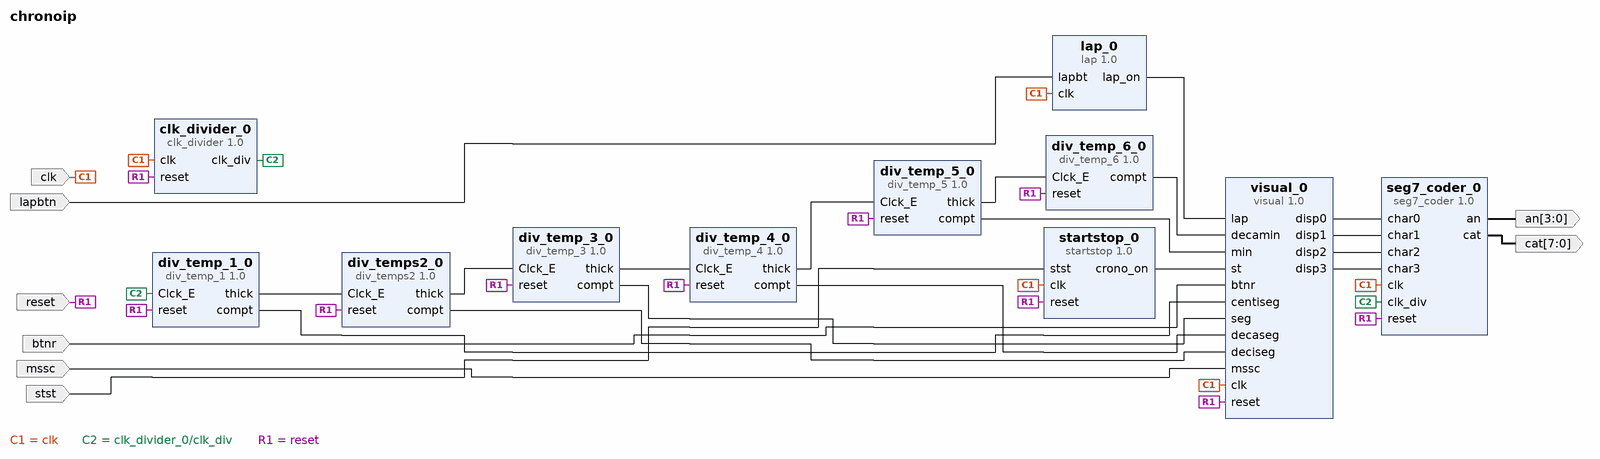
[diagram p0: block diagram of the top level]
# Vivado block design chronoip, xc7a35tcpg236-1, Vivado 2022.1
create_bd_design chronoip

create_bd_port -dir I reset
create_bd_port -dir I clk
create_bd_port -dir I mssc
create_bd_port -dir O -from 3 -to 0 an
create_bd_port -dir O -from 7 -to 0 cat
create_bd_port -dir I stst
create_bd_port -dir I btnr
create_bd_port -dir I lapbtn

create_bd_cell -type ip -vlnv xilinx.com:user:clk_divider:1.0 clk_divider_0
create_bd_cell -type ip -vlnv xilinx.com:user:div_temp_1:1.0 div_temp_1_0
create_bd_cell -type ip -vlnv xilinx.com:user:div_temps2:1.0 div_temps2_0
create_bd_cell -type ip -vlnv xilinx.com:user:div_temp_3:1.0 div_temp_3_0
create_bd_cell -type ip -vlnv xilinx.com:user:div_temp_4:1.0 div_temp_4_0
create_bd_cell -type ip -vlnv xilinx.com:user:div_temp_5:1.0 div_temp_5_0
create_bd_cell -type ip -vlnv xilinx.com:user:div_temp_6:1.0 div_temp_6_0
create_bd_cell -type ip -vlnv xilinx.com:user:seg7_coder:1.0 seg7_coder_0
create_bd_cell -type ip -vlnv xilinx.com:user:startstop:1.0 startstop_0
create_bd_cell -type ip -vlnv xilinx.com:user:lap:1.0 lap_0
create_bd_cell -type ip -vlnv xilinx.com:user:visual:1.0 visual_0

# ---- connections ----

connect_bd_net [get_bd_ports btnr] [get_bd_pins visual_0/btnr]
connect_bd_net [get_bd_ports clk] \
  [get_bd_pins clk_divider_0/clk] [get_bd_pins seg7_coder_0/clk] [get_bd_pins startstop_0/clk] [get_bd_pins lap_0/clk] \
  [get_bd_pins visual_0/clk]
connect_bd_net [get_bd_pins clk_divider_0/clk_div] [get_bd_pins div_temp_1_0/Clck_E] [get_bd_pins seg7_coder_0/clk_div]
connect_bd_net [get_bd_pins div_temp_1_0/compt] [get_bd_pins visual_0/centiseg]
connect_bd_net [get_bd_pins div_temp_1_0/thick] [get_bd_pins div_temps2_0/Clck_E]
connect_bd_net [get_bd_pins div_temp_3_0/compt] [get_bd_pins visual_0/seg]
connect_bd_net [get_bd_pins div_temp_3_0/thick] [get_bd_pins div_temp_4_0/Clck_E]
connect_bd_net [get_bd_pins div_temp_4_0/compt] [get_bd_pins visual_0/decaseg]
connect_bd_net [get_bd_pins div_temp_4_0/thick] [get_bd_pins div_temp_5_0/Clck_E]
connect_bd_net [get_bd_pins div_temp_5_0/compt] [get_bd_pins visual_0/min]
connect_bd_net [get_bd_pins div_temp_5_0/thick] [get_bd_pins div_temp_6_0/Clck_E]
connect_bd_net [get_bd_pins div_temp_6_0/compt] [get_bd_pins visual_0/decamin]
connect_bd_net [get_bd_pins div_temps2_0/compt] [get_bd_pins visual_0/deciseg]
connect_bd_net [get_bd_pins div_temps2_0/thick] [get_bd_pins div_temp_3_0/Clck_E]
connect_bd_net [get_bd_pins lap_0/lap_on] [get_bd_pins visual_0/lap]
connect_bd_net [get_bd_ports lapbtn] [get_bd_pins lap_0/lapbt]
connect_bd_net [get_bd_ports mssc] [get_bd_pins visual_0/mssc]
connect_bd_net [get_bd_ports reset] \
  [get_bd_pins seg7_coder_0/reset] [get_bd_pins div_temp_1_0/reset] [get_bd_pins clk_divider_0/reset] \
  [get_bd_pins div_temp_3_0/reset] [get_bd_pins div_temp_4_0/reset] [get_bd_pins div_temp_5_0/reset] \
  [get_bd_pins div_temp_6_0/reset] [get_bd_pins div_temps2_0/reset] [get_bd_pins startstop_0/reset] \
  [get_bd_pins visual_0/reset]
connect_bd_net [get_bd_pins seg7_coder_0/an] [get_bd_ports an]
connect_bd_net [get_bd_pins seg7_coder_0/cat] [get_bd_ports cat]
connect_bd_net [get_bd_pins startstop_0/crono_on] [get_bd_pins visual_0/st]
connect_bd_net [get_bd_ports stst] [get_bd_pins startstop_0/stst]
connect_bd_net [get_bd_pins visual_0/disp0] [get_bd_pins seg7_coder_0/char0]
connect_bd_net [get_bd_pins visual_0/disp1] [get_bd_pins seg7_coder_0/char1]
connect_bd_net [get_bd_pins visual_0/disp2] [get_bd_pins seg7_coder_0/char2]
connect_bd_net [get_bd_pins visual_0/disp3] [get_bd_pins seg7_coder_0/char3]

validate_bd_design
save_bd_design
